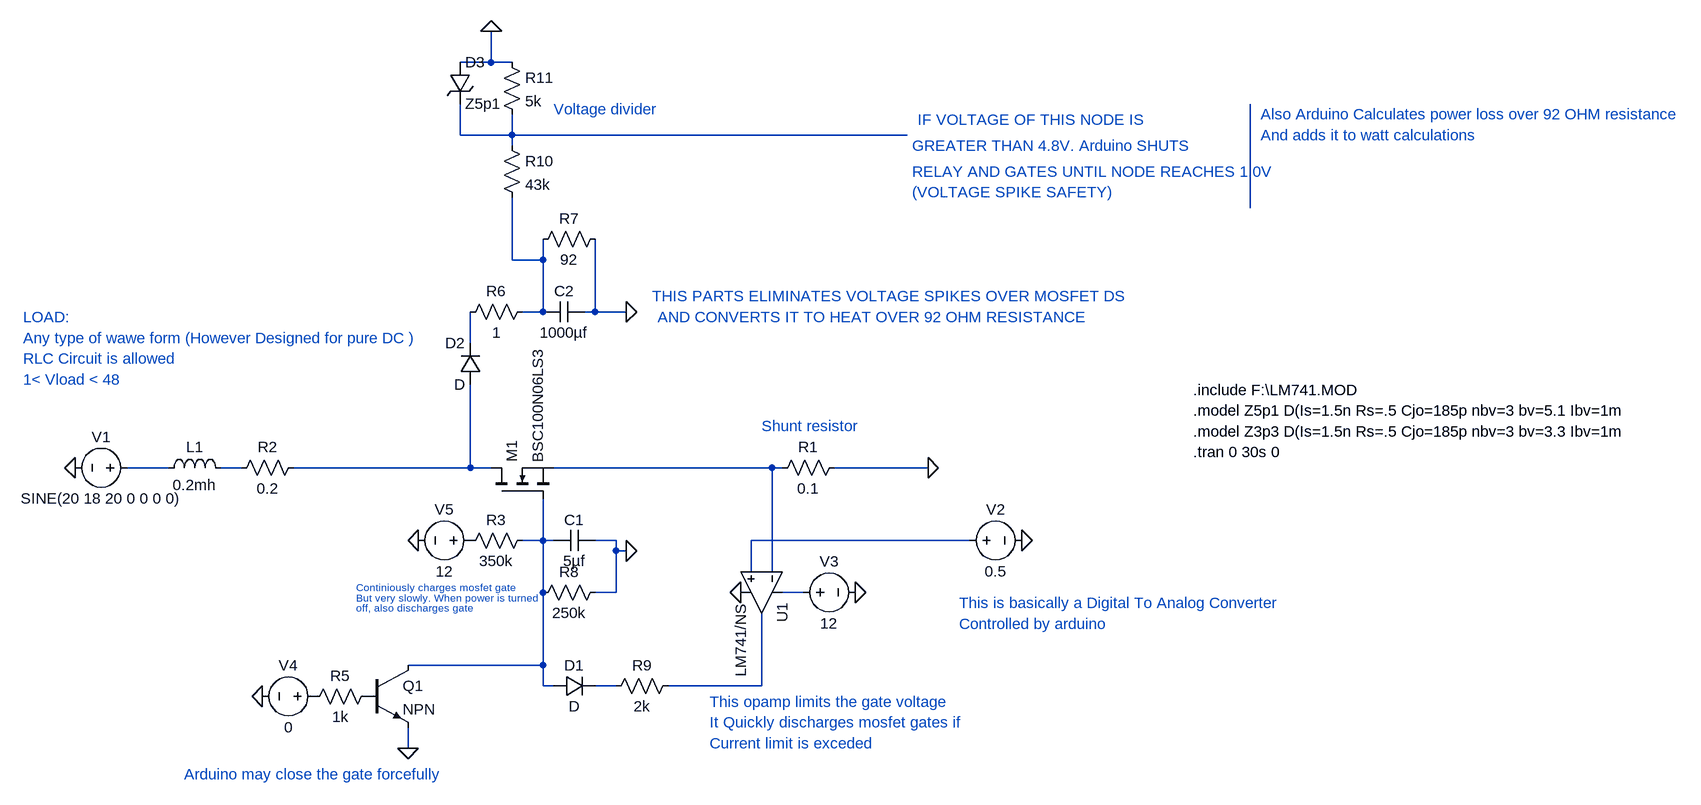
[diagram p0: schematic FINISHED DUMMY LOAD MOSFET PART.asc]
FINISHED DUMMY LOAD MOSFET PART.asc, the LTspice schematic file:
Version 4
SHEET 1 2468 680
WIRE 592 -512 592 -560
WIRE 592 -512 544 -512
WIRE 624 -512 592 -512
WIRE 544 -400 544 -448
WIRE 624 -400 624 -432
WIRE 624 -400 544 -400
WIRE 1232 -400 624 -400
WIRE 624 -384 624 -400
WIRE 1760 -288 1760 -448
WIRE 624 -208 624 -304
WIRE 672 -208 672 -240
WIRE 672 -208 624 -208
WIRE 672 -128 672 -208
WIRE 672 -128 640 -128
WIRE 752 -128 752 -240
WIRE 752 -128 736 -128
WIRE 800 -128 752 -128
WIRE 560 -80 560 -128
WIRE 96 112 32 112
WIRE 208 112 176 112
WIRE 560 112 560 -16
WIRE 560 112 288 112
WIRE 592 112 560 112
WIRE 1024 112 688 112
WIRE 1040 112 1024 112
WIRE 1264 112 1120 112
WIRE 672 224 672 160
WIRE 672 224 640 224
WIRE 688 224 672 224
WIRE 784 224 752 224
WIRE 1328 224 992 224
WIRE 784 240 784 224
WIRE 800 240 784 240
WIRE 992 272 992 224
WIRE 1024 272 1024 112
WIRE 672 304 672 224
WIRE 784 304 784 240
WIRE 784 304 752 304
WIRE 1072 304 1040 304
WIRE 672 416 672 304
WIRE 672 416 464 416
WIRE 672 448 672 416
WIRE 688 448 672 448
WIRE 784 448 752 448
WIRE 1008 448 1008 336
WIRE 1008 448 864 448
WIRE 464 544 464 512
FLAG -48 112 0
FLAG 1152 304 0
FLAG 976 304 0
FLAG 464 544 0
FLAG 240 464 0
FLAG 800 -128 0
FLAG 480 224 0
FLAG 592 -560 0
FLAG 1408 224 0
FLAG 800 240 0
FLAG 1264 112 0
SYMBOL OpAmps\\opamp2 1072 304 R90
SYMATTR InstName U1
SYMATTR Value LM741/NS
SYMBOL nmos 592 160 R270
SYMATTR InstName M1
SYMATTR Value BSC100N06LS3
SYMBOL res 1136 96 R90
WINDOW 0 0 56 VBottom 2
WINDOW 3 32 56 VTop 2
SYMATTR InstName R1
SYMATTR Value 0.1
SYMBOL res 304 96 R90
WINDOW 0 0 56 VBottom 2
WINDOW 3 32 56 VTop 2
SYMATTR InstName R2
SYMATTR Value 0.2
SYMBOL voltage 48 112 R90
WINDOW 0 -32 56 VBottom 2
WINDOW 3 32 56 VTop 2
WINDOW 123 0 0 Left 0
WINDOW 39 0 0 Left 0
SYMATTR InstName V1
SYMATTR Value SINE(20 18 20 0 0 0 0)
SYMBOL voltage 1056 304 R270
WINDOW 0 32 56 VTop 2
WINDOW 3 -32 56 VBottom 2
WINDOW 123 0 0 Left 0
WINDOW 39 0 0 Left 0
SYMATTR InstName V3
SYMATTR Value 12
SYMBOL ind 80 128 R270
WINDOW 0 32 56 VTop 2
WINDOW 3 5 56 VBottom 2
SYMATTR InstName L1
SYMATTR Value 0.2mh
SYMBOL npn 400 416 R0
SYMATTR InstName Q1
SYMBOL res 416 448 R90
WINDOW 0 0 56 VBottom 2
WINDOW 3 32 56 VTop 2
SYMATTR InstName R5
SYMATTR Value 1k
SYMBOL voltage 336 464 R90
WINDOW 0 -32 56 VBottom 2
WINDOW 3 32 56 VTop 2
WINDOW 123 0 0 Left 0
WINDOW 39 0 0 Left 0
SYMATTR InstName V4
SYMATTR Value 0
SYMBOL cap 736 -144 R90
WINDOW 0 0 32 VBottom 2
WINDOW 3 32 32 VTop 2
SYMATTR InstName C2
SYMATTR Value 1000µf
SYMBOL res 768 -256 R90
WINDOW 0 0 56 VBottom 2
WINDOW 3 32 56 VTop 2
SYMATTR InstName R7
SYMATTR Value 92
SYMBOL diode 576 -16 R180
WINDOW 0 24 64 Left 2
WINDOW 3 24 0 Left 2
SYMATTR InstName D2
SYMBOL res 656 -144 R90
WINDOW 0 0 56 VBottom 2
WINDOW 3 32 56 VTop 2
SYMATTR InstName R6
SYMATTR Value 1
SYMBOL res 656 208 R90
WINDOW 0 0 56 VBottom 2
WINDOW 3 32 56 VTop 2
SYMATTR InstName R3
SYMATTR Value 350k
SYMBOL diode 688 464 R270
WINDOW 0 32 32 VTop 2
WINDOW 3 0 32 VBottom 2
SYMATTR InstName D1
SYMBOL voltage 576 224 R90
WINDOW 0 -32 56 VBottom 2
WINDOW 3 32 56 VTop 2
WINDOW 123 0 0 Left 0
WINDOW 39 0 0 Left 0
SYMATTR InstName V5
SYMATTR Value 12
SYMBOL res 880 432 R90
WINDOW 0 0 56 VBottom 2
WINDOW 3 32 56 VTop 2
SYMATTR InstName R9
SYMATTR Value 2k
SYMBOL res 768 288 R90
WINDOW 0 0 56 VBottom 2
WINDOW 3 32 56 VTop 2
SYMATTR InstName R8
SYMATTR Value 250k
SYMBOL cap 752 208 R90
WINDOW 0 0 32 VBottom 2
WINDOW 3 32 32 VTop 2
SYMATTR InstName C1
SYMATTR Value 5µf
SYMBOL res 608 -400 R0
SYMATTR InstName R10
SYMATTR Value 43k
SYMBOL res 608 -528 R0
SYMATTR InstName R11
SYMATTR Value 5k
SYMBOL zener 528 -512 R0
SYMATTR InstName D3
SYMATTR Value Z5p1
SYMBOL voltage 1312 224 R270
WINDOW 0 32 56 VTop 2
WINDOW 3 -32 56 VBottom 2
WINDOW 123 0 0 Left 0
WINDOW 39 0 0 Left 0
SYMATTR InstName V2
SYMATTR Value 0.5
TEXT 1672 -8 Left 2 !.include F:\\LM741.MOD
TEXT 1672 88 Left 2 !.tran 0 30s 0
TEXT 1672 24 Left 2 !.model Z5p1 D(Is=1.5n Rs=.5 Cjo=185p nbv=3 bv=5.1 Ibv=1m
TEXT 1672 56 Left 2 !.model Z3p3 D(Is=1.5n Rs=.5 Cjo=185p nbv=3 bv=3.3 Ibv=1m
TEXT 1248 -424 Left 2 ;IF VOLTAGE OF THIS NODE IS
TEXT 1240 -384 Left 2 ;GREATER THAN 4.8V. Arduino SHUTS
TEXT 1240 -344 Left 2 ;RELAY AND GATES UNTIL NODE REACHES 1.0V
TEXT 840 -152 Left 2 ;THIS PARTS ELIMINATES VOLTAGE SPIKES OVER MOSFET DS
TEXT 848 -120 Left 2 ;AND CONVERTS IT TO HEAT OVER 92 OHM RESISTANCE
TEXT 1240 -312 Left 2 ;(VOLTAGE SPIKE SAFETY)
TEXT 1776 -432 Left 2 ;Also Arduino Calculates power loss over 92 OHM resistance
TEXT 1776 -400 Left 2 ;And adds it to watt calculations
TEXT 1312 320 Left 2 ;This is basically a Digital To Analog Converter
TEXT 1312 352 Left 2 ;Controlled by arduino
TEXT 928 472 Left 2 ;This opamp limits the gate voltage
TEXT 928 504 Left 2 ;It Quickly discharges mosfet gates if
TEXT 928 536 Left 2 ;Current limit is exceded
TEXT 384 296 Left 1 ;Continiously charges mosfet gate
TEXT 384 312 Left 1 ;But very slowly. When power is turned
TEXT 384 328 Left 1 ;off, also discharges gate
TEXT 120 584 Left 2 ;Arduino may close the gate forcefully
TEXT 688 -440 Left 2 ;Voltage divider
TEXT 1008 48 Left 2 ;Shunt resistor
TEXT -128 -120 Left 2 ;LOAD:
TEXT -128 -88 Left 2 ;Any type of wawe form (However Designed for pure DC )
TEXT -128 -56 Left 2 ;RLC Circuit is allowed
TEXT -128 -24 Left 2 ;1< Vload < 48

The netlist it stands for:
* FINISHED DUMMY LOAD MOSFET PART.asc
XU1 N010 N008 N011 0 N013 LM741/NS  ; pins In+ In- V+ V- OUT
M1 N007 N009 N008 N008 BSC100N06LS3
R1 0 N008 0.1
R2 N007 N006 0.2
V1 N005 0 SINE(20 18 20 0 0 0 0)
V3 N011 0 12
L1 N005 N006 0.2mh
Q1 N009 P001 0 0 NPN
R5 P001 P002 1k
V4 P002 0 0
C2 0 N003 1000µf
R7 0 N003 92
D2 N007 N004 D
R6 N003 N004 1
R3 N009 P003 350k
D1 N009 N012 D
V5 P003 0 12
R9 N013 N012 2k
R8 0 N009 250k
C1 0 N009 5µf
R10 N001 N003 43k
R11 0 N001 5k
D3 0 N001 Z5p1
V2 N010 0 0.5
.model D D
.lib standard.dio
.model NPN NPN
.model PNP PNP
.lib standard.bjt
.model NMOS NMOS
.model PMOS PMOS
.lib standard.mos
.include F:\LM741.MOD
.tran 0 30s 0
.model Z5p1 D(Is=1.5n Rs=.5 Cjo=185p nbv=3 bv=5.1 Ibv=1m
.model Z3p3 D(Is=1.5n Rs=.5 Cjo=185p nbv=3 bv=3.3 Ibv=1m
* IF VOLTAGE OF THIS NODE IS
* GREATER THAN 4.8V. Arduino SHUTS
* RELAY AND GATES UNTIL NODE REACHES 1.0V
* THIS PARTS ELIMINATES VOLTAGE SPIKES OVER MOSFET DS
* AND CONVERTS IT TO HEAT OVER 92 OHM RESISTANCE
* (VOLTAGE SPIKE SAFETY)
* Also Arduino Calculates power loss over 92 OHM resistance
* And adds it to watt calculations
* This is basically a Digital To Analog Converter
* Controlled by arduino
* This opamp limits the gate voltage
* It Quickly discharges mosfet gates if
* Current limit is exceded
* Continiously charges mosfet gate
* But very slowly. When power is turned
* off, also discharges gate
* Arduino may close the gate forcefully
* Voltage divider
* Shunt resistor
* LOAD:
* Any type of wawe form (However Designed for pure DC )
* RLC Circuit is allowed
* 1< Vload < 48
.backanno
.end